# Altium schematic sheet Bluetooth_Module.SchDoc: Bluetooth Module
size A4
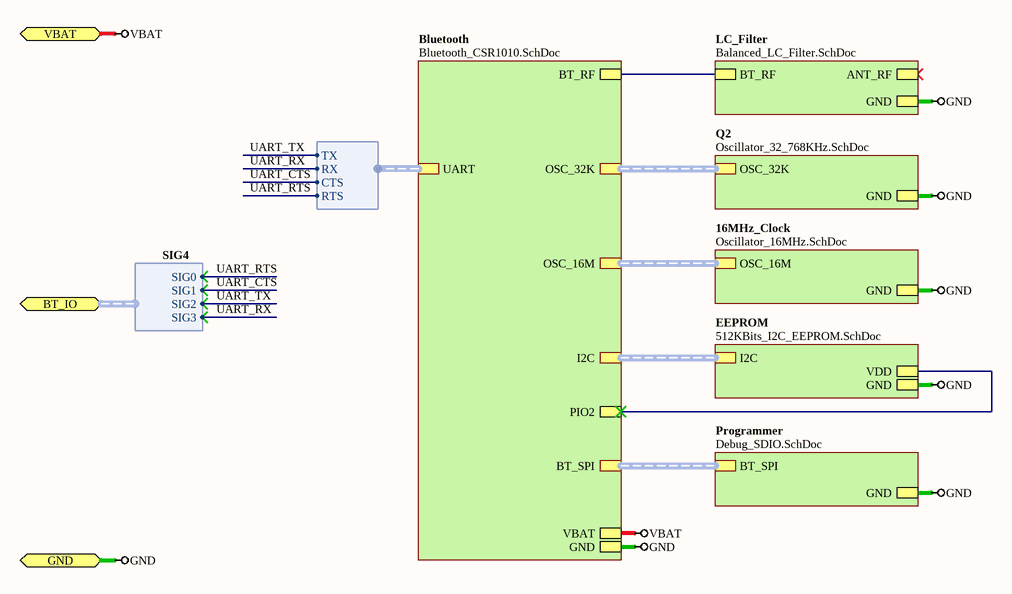
[diagram p0: Bluetooth_Module.SchDoc]

## Sub-sheets
16MHz_Clock = Oscillator_16MHz.SchDoc: GND, OSC_16M (harness OSC)
Bluetooth = Bluetooth_CSR1010.SchDoc: BT_RF, VBAT, GND, UART (harness UART_HS), I2C (harness I2C), BT_SPI (harness SPI_CSR1010), PIO2, OSC_32K (harness OSC), OSC_16M (harness OSC)
EEPROM = 512KBits_I2C_EEPROM.SchDoc: GND, VDD, I2C (harness I2C)
LC_Filter = Balanced_LC_Filter.SchDoc: BT_RF, GND, ANT_RF
Programmer = Debug_SDIO.SchDoc: GND, BT_SPI (harness SPI_CSR1010)
Q2 = Oscillator_32_768KHz.SchDoc: GND, OSC_32K (harness OSC)

## Ports
BT_IO (harness SIG4), GND, VBAT

## Harnesses
SIG4: SIG0, SIG1, SIG2, SIG3
UART_HS: RX, RTS, TX, CTS

## Nets
GND: port GND, sheet Programmer/GND, sheet EEPROM/GND, sheet LC_Filter/GND, sheet Q2/GND, sheet 16MHz_Clock/GND, sheet Bluetooth/GND
VBAT: port VBAT, sheet Bluetooth/VBAT
UART_CTS: port BT_IO.SIG1, sheet Bluetooth/UART.CTS
UART_RTS: port BT_IO.SIG0, sheet Bluetooth/UART.RTS
UART_RX: port BT_IO.SIG3, sheet Bluetooth/UART.RX
UART_TX: port BT_IO.SIG2, sheet Bluetooth/UART.TX
(unnamed): sheet EEPROM/VDD, sheet Bluetooth/PIO2
(unnamed): sheet LC_Filter/BT_RF, sheet Bluetooth/BT_RF

## Buses and harness runs
harness sheet 16MHz_Clock/OSC_16M = sheet Bluetooth/OSC_16M
harness sheet Bluetooth/BT_SPI = sheet Programmer/BT_SPI
harness sheet Bluetooth/I2C = sheet EEPROM/I2C
harness sheet Bluetooth/OSC_32K = sheet Q2/OSC_32K

## Notes on the sheet
- Sheet Title
- Project Title
- Size:
- Date:
- A4
- Item:
- Time:
- Revision:
- Sheet
- of
- File: